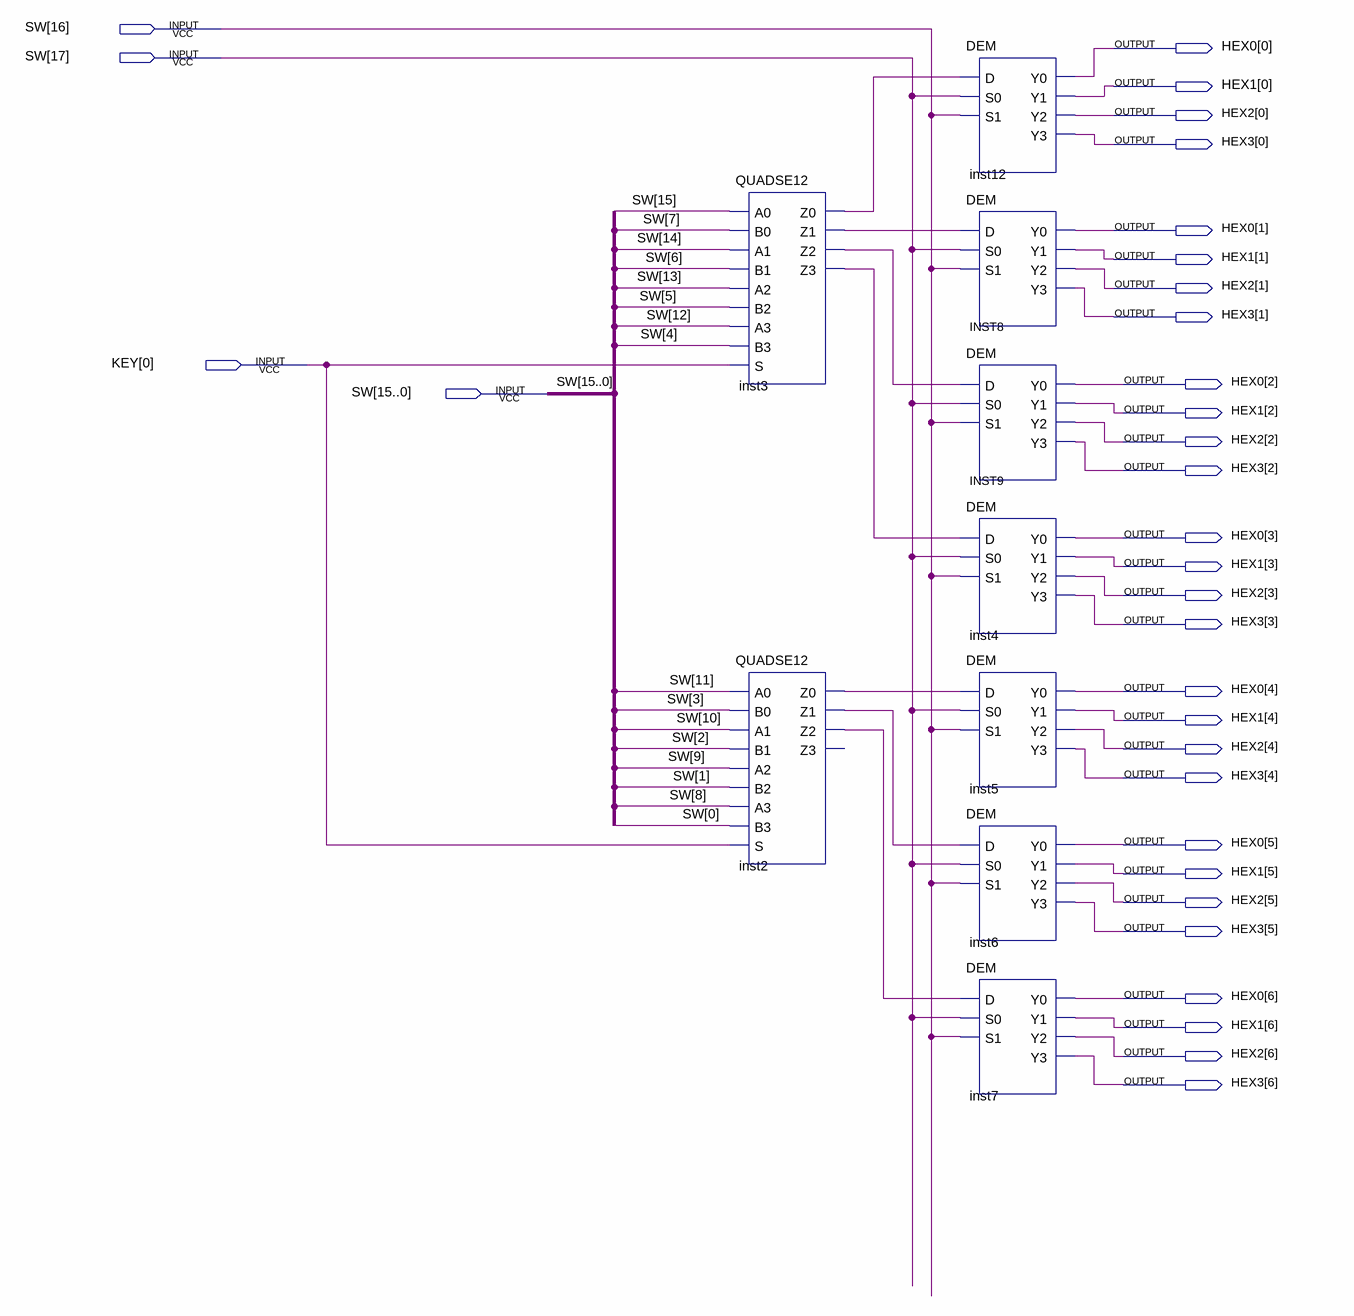
[diagram p0: schematic sheet]
// Quartus schematic Lab6.bdf as structural Verilog: 9 symbols, 32 pins
module Lab6 (
  input  [17:0] SW,
  input  [0:0] KEY,
  output [6:0] HEX0,
  output [6:0] HEX1,
  output [6:0] HEX2,
  output [6:0] HEX3
);

  wire inst2_z0, inst2_z1, inst2_z2, inst3_z0, inst3_z1, inst3_z2, inst3_z3;

  QUADSE12 inst3 (
    .A0(SW[15]), .B0(SW[7]), .A1(SW[14]), .B1(SW[6]), .A2(SW[13]), .B2(SW[5]), .A3(SW[12]), .B3(SW[4]),
    .S(KEY[0]), .Z0(inst3_z0), .Z1(inst3_z1), .Z2(inst3_z2), .Z3(inst3_z3));
  QUADSE12 inst2 (
    .A0(SW[11]), .B0(SW[3]), .A1(SW[10]), .B1(SW[2]), .A2(SW[9]), .B2(SW[1]), .A3(SW[8]), .B3(SW[0]),
    .S(KEY[0]), .Z0(inst2_z0), .Z1(inst2_z1), .Z2(inst2_z2));  // open: Z3
  DEM inst12 (.D(inst3_z0), .S0(SW[17]), .S1(SW[16]), .Y0(HEX0[0]), .Y1(HEX1[0]), .Y2(HEX2[0]), .Y3(HEX3[0]));
  DEM INST8 (.D(inst3_z1), .S0(SW[17]), .S1(SW[16]), .Y0(HEX0[1]), .Y1(HEX1[1]), .Y2(HEX2[1]), .Y3(HEX3[1]));
  DEM INST9 (.D(inst3_z2), .S0(SW[17]), .S1(SW[16]), .Y0(HEX0[2]), .Y1(HEX1[2]), .Y2(HEX2[2]), .Y3(HEX3[2]));
  DEM inst4 (.D(inst3_z3), .S0(SW[17]), .S1(SW[16]), .Y0(HEX0[3]), .Y1(HEX1[3]), .Y2(HEX2[3]), .Y3(HEX3[3]));
  DEM inst5 (.D(inst2_z0), .S0(SW[17]), .S1(SW[16]), .Y0(HEX0[4]), .Y1(HEX1[4]), .Y2(HEX2[4]), .Y3(HEX3[4]));
  DEM inst6 (.D(inst2_z1), .S0(SW[17]), .S1(SW[16]), .Y0(HEX0[5]), .Y1(HEX1[5]), .Y2(HEX2[5]), .Y3(HEX3[5]));
  DEM inst7 (.D(inst2_z2), .S0(SW[17]), .S1(SW[16]), .Y0(HEX0[6]), .Y1(HEX1[6]), .Y2(HEX2[6]), .Y3(HEX3[6]));
endmodule
